# Altium project Medidor Sensor Thawann.PrjPCB
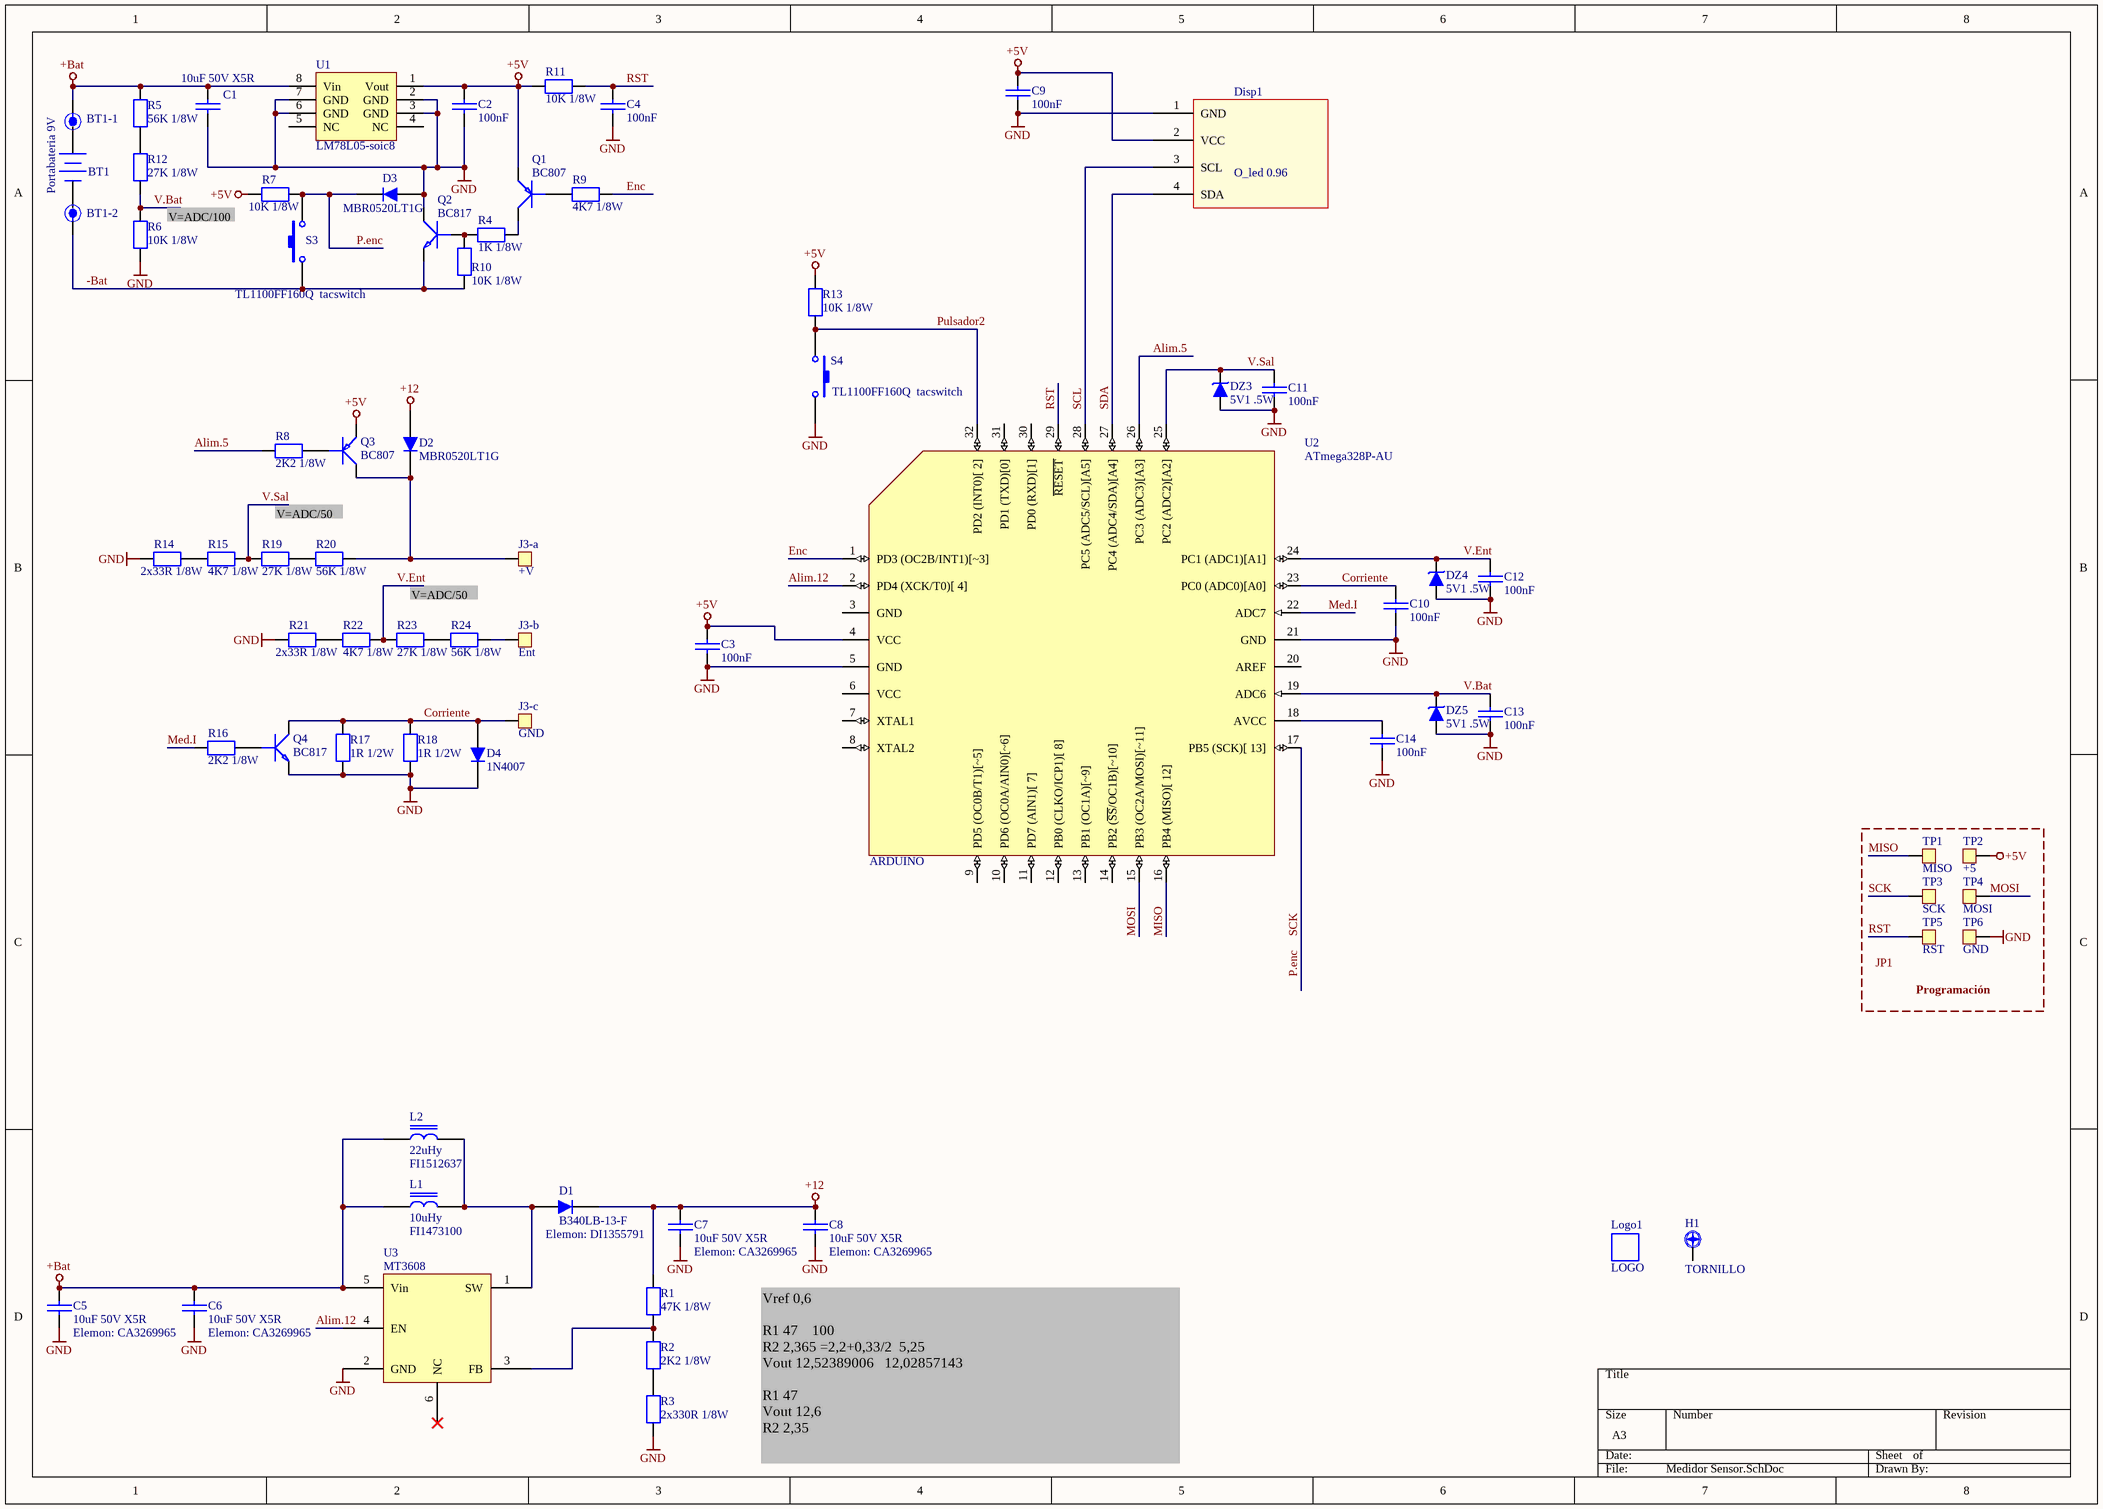
[diagram p0: Medidor Sensor.SchDoc]
1 sheet, 71 parts. Net scope: global (net labels, ports and power ports of the same name join across sheets).
Board file: Medidor Sensor.PcbDoc

## Sheet Medidor Sensor.SchDoc
size A3

### Parts
BT1  value Portabateria 9V  [BAT-2]  (graphical)
BT1-1  TEST POINT  [TP_1]  (value not drawn)
BT1-2  TEST POINT  [TP_1]  (value not drawn)
C1  10uF 50V X5R  [C0805Minimo]
C2  100nF  [C0805Minimo]
C3  100nF  [C0805Minimo]
C4  100nF  [C0805Minimo]
C5  10uF 50V X5R  Elemon: CA3269965  [C1206]
C6  10uF 50V X5R  Elemon: CA3269965  [C1206]
C7  10uF 50V X5R  Elemon: CA3269965  [C1206]
C8  10uF 50V X5R  Elemon: CA3269965  [C1206]
C9  100nF  [C0805Minimo]
C10  100nF  [C0805Minimo]
C11  100nF  [C0805Minimo]
C12  100nF  [C0805Minimo]
C13  100nF  [C0805Minimo]
C14  100nF  [C0805Minimo]
D1  B340LB-13-F  Elemon: DI1355791  [smb]
D2  MBR0520LT1G  [DL35]
D3  MBR0520LT1G  [DL35]
D4  1N4007  [DL45]
Disp1  O_led 0.96  [Oled 0.96 Nodotech]
DZ3  5V1 .5W  [DL35]
DZ4  5V1 .5W  [DL35]
DZ5  5V1 .5W  [DL35]
H1  TORNILLO  [Tornillo]  (no BOM)
J3-a  +V  [TP_1]  (no BOM)
J3-b  Ent  [TP_1]  (no BOM)
J3-c  GND  [TP_1]  (no BOM)
L1  10uHy  Elemon: FI1473100  [L1210]
L2  22uHy  Elemon: FI1512637  [SMTDR0804]
Logo1  LOGO  [IMW Serigrafía]  (no BOM)
Q1  BC807  [SOT23 - BC817]
Q2  BC817  [SOT23 - BC817]
Q3  BC807  [SOT23 - BC817]
Q4  BC817  [SOT23 - BC817]
R1  47K 1/8W  [R0805Minimo]
R2  2K2 1/8W  [R0805Minimo]
R3  2x330R 1/8W  [R0805Minimo]
R4  1K 1/8W  [R0805Minimo]
R5  56K 1/8W  [R0805Minimo]
R6  10K 1/8W  [R0805Minimo]
R7  10K 1/8W  [R0805Minimo]
R8  2K2 1/8W  [R0805Minimo]
R9  4K7 1/8W  [R0805Minimo]
R10  10K 1/8W  [R0805Minimo]
R11  10K 1/8W  [R0805Minimo]
R12  27K 1/8W  [R0805Minimo]
R13  10K 1/8W  [R0805Minimo]
R14  2x33R 1/8W  [R0805Minimo]
R15  4K7 1/8W  [R0805Minimo]
R16  2K2 1/8W  [R0805Minimo]
R17  1R 1/2W  [R1210]
R18  1R 1/2W  [R1210]
R19  27K 1/8W  [R0805Minimo]
R20  56K 1/8W  [R0805Minimo]
R21  2x33R 1/8W  [R0805Minimo]
R22  4K7 1/8W  [R0805Minimo]
R23  27K 1/8W  [R0805Minimo]
R24  56K 1/8W  [R0805Minimo]
S3  value TL1100FF160Q  tacswitch  [Pul 12x12 Omron B3F]
S4  value TL1100FF160Q  tacswitch  [Pul 12x12 Omron B3F]
TP1  MISO  [TP_0]  (no BOM)
TP2  +5  [TP_0]  (no BOM)
TP3  SCK  [TP_0]  (no BOM)
TP4  MOSI  [TP_0]  (no BOM)
TP5  RST  [TP_0]  (no BOM)
TP6  GND  [TP_0]  (no BOM)
U1  LM78L05-soic8  [SOIC8-150]
U2  ATmega328P-AU  [TQFP32]
U3  MT3608  [sot23-6]

### Nets
+5V: C2.1 C3.1 C9.1 Disp1.2(VCC) Q1.3(E) Q3.3(E) R7.2 R11.2 R13.1 TP2.1 U1.1(Vout) U2.4(VCC)
+12: C7.1 C8.1 D1.2 D2.1 R1.1
+Bat: BT1-1.1 C1.1 C5.1 C6.1 L1.1 L2.1 R5.2 U1.8(Vin) U3.5(Vin)
GND: C1.2 C2.2 C3.2 C4.2 C5.2 C6.2 C7.2 C8.2 C9.2 C10.2 C11.2 C12.2 C13.2 C14.2 D3.1 D4.2 Disp1.1(GND) DZ3.1 DZ4.1 DZ5.1 Q2.2(C) Q4.3(E) R3.2 R6.1 R14.1 R17.1 R18.1 R21.1 S4.2 TP6.1 U1.2(GND) U1.3(GND) U1.6(GND) U1.7(GND) U2.5(GND) U2.21(GND) U3.2(GND)
-Bat: BT1-2.1 Q2.3(E) R10.2 S3.1
Alim.5: R8.1 U2.26(PC3_(ADC3)[A3])
Alim.12: U2.2(PD4_(XCK/T0)[_4]) U3.4(EN)
Corriente: C10.1 D4.1 J3-c.1 Q4.2(C) R17.2 R18.2 U2.23(PC0_(ADC0)[A0])
Enc: R9.1 U2.1(PD3_(OC2B/INT1)[~3])
Med.I: R16.2 U2.22(ADC7)
MISO: TP1.1 U2.16(PB4_(MISO)[_12])
MOSI: TP4.1 U2.15(PB3_(OC2A/MOSI)[~11])
P.enc: D3.2 R7.1 S3.2 TP3.1 U2.17(PB5_(SCK)[_13])  [also labelled SCK]
Pulsador2: R13.2 S4.1 U2.32(PD2_(INT0)[_2])
RST: C4.1 R11.1 TP5.1 U2.29(~{RESET})
SCL: Disp1.3(SCL) U2.28(PC5_(ADC5/SCL)[A5])
SDA: Disp1.4(SDA) U2.27(PC4_(ADC4/SDA)[A4])
V.Bat: C13.1 DZ5.2 R6.2 R12.2 U2.19(ADC6)
V.Ent: C12.1 DZ4.2 R22.2 R23.2 U2.24(PC1_(ADC1)[A1])
V.Sal: C11.1 DZ3.2 R15.2 R19.2 U2.25(PC2_(ADC2)[A2])
NetC14_1: C14.1 U2.18(AVCC)
NetD1_1: D1.1 L1.2 L2.2 U3.1(SW)
NetD2_2: D2.2 J3-a.1 Q3.2(C) R20.2
NetJ3-b_1: J3-b.1 R24.2
NetQ1_1: Q1.1(B) R9.2
NetQ1_2: Q1.2(C) R4.2
NetQ2_1: Q2.1(B) R4.1 R10.1
NetQ3_1: Q3.1(B) R8.2
NetQ4_1: Q4.1(B) R16.1
NetR1_2: R1.2 R2.2 U3.3(FB)
NetR2_1: R2.1 R3.1
NetR5_1: R5.1 R12.1
NetR14_2: R14.2 R15.1
NetR19_1: R19.1 R20.1
NetR21_2: R21.2 R22.1
NetR23_1: R23.1 R24.1

Not connected (* = marked no-connect by the designer): BT1 1(+) 2(-); H1 1; U1 4(NC) 5(NC); U2 3(GND) 6(VCC) 7(XTAL1) 8(XTAL2) 9(PD5_(OC0B/T1)[~5]) 10(PD6_(OC0A/AIN0)[~6]) 11(PD7_(AIN1)[_7]) 12(PB0_(CLKO/ICP1)[_8]) 13(PB1_(OC1A)[~9]) 14(PB2_(~{SS}/OC1B)[~10]) 20(AREF) 30(PD0_(RXD)[1]) 31(PD1_(TXD)[0]); U3 6(NC)*

### Notes on the sheet
- V=ADC/100
- V=ADC/50
- (near TP5) JP1
- Programación
- Vref	0,6
  R1	47				100
  R2	2,365	=2,2+0,33/2		5,25
  Vout	12,52389006			12,02857143
  R1	47
  Vout	12,6
  R2	2,35
- (in symbol ARDUINO ATmega328P-AU) ARDUINO

### Library data of the parts
BT1 = Battery: Multicell Battery; Manufacturer: Generic Components; Published: 1999
BT1-1 BT1-2 = TEST POINT: Tst Point
C1-C14 = CAP NP: Capacitor
D1-D4 = DIODE-SMALL: DIODE
Disp1 = O_led_0.96: Disp
DZ3-DZ5 = ZENER-SMALL: Zener Diode
J3-a J3-b J3-c TP1-TP6 = TESTPOINT: TEST POINT
L1 L2 = INDUCTOR CHOKE
Logo1 = LOGO: Logo Institucional
Q1 Q3 = BC807: TRANSISTOR
Q2 Q4 = BC817: TRANSISTOR
R1-R3 R11-R13 R17-R19 R23 = RES_SMALL: Resistencia
R4-R10 R14-R16 R20-R22 R24 = RESISTOR: Resistencia
S3 S4 = SW-PB: Switch; Manufacturer: Generic Components; Published: 1999
U1 = LM78L05-soic8: IC
U2 = ARDUINO ATmega328P-AU: IC; Published: *; DatasheetVersion: *; PackageVersion: *; PackageReference: *; Publisher: *; PackageDescription: *; Supplier 1: *; Supplier Part Number 1: *; Supplier 2: *; Supplier Part Number 2: *; Supplier 3: *; Supplier Part Number 3: *; Code_JEDEC: *; ComponentLink1Description: *; ComponentLink1URL: *; ComponentLink2Description: *
U3 = MT3608: IC